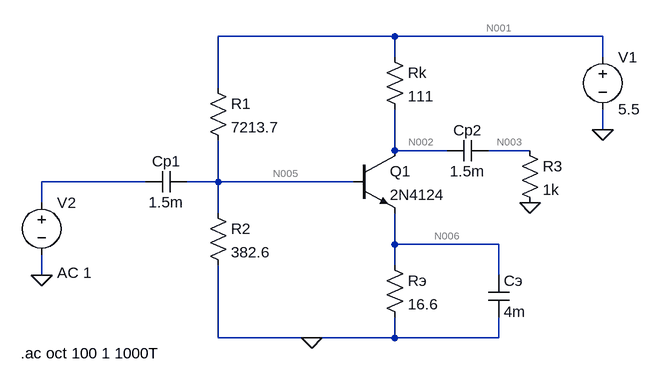
[diagram p0: schematic 2.asc]
2.asc, the LTspice schematic file:
Version 4
SHEET 1 1124 680
WIRE 560 -64 288 -64
WIRE 880 -64 560 -64
WIRE 560 -32 560 -64
WIRE 880 -32 880 -64
WIRE 288 16 288 -64
WIRE 880 80 880 48
WIRE 560 112 560 48
WIRE 640 112 560 112
WIRE 768 112 704 112
WIRE 176 160 16 160
WIRE 288 160 288 96
WIRE 288 160 240 160
WIRE 496 160 288 160
WIRE 16 192 16 160
WIRE 288 208 288 160
WIRE 560 256 560 208
WIRE 720 256 560 256
WIRE 560 288 560 256
WIRE 16 304 16 272
WIRE 720 304 720 256
WIRE 288 400 288 288
WIRE 432 400 288 400
WIRE 560 400 560 368
WIRE 560 400 432 400
WIRE 720 400 720 368
WIRE 720 400 560 400
FLAG 16 304 0
FLAG 432 400 0
FLAG 880 80 0
FLAG 768 192 0
SYMBOL voltage 16 176 R0
WINDOW 123 24 124 Left 2
WINDOW 39 0 0 Left 0
SYMATTR Value2 AC 1
SYMATTR InstName V2
SYMATTR Value ""
SYMBOL cap 240 144 R90
WINDOW 0 0 32 VBottom 2
WINDOW 3 32 32 VTop 2
SYMATTR InstName Cp1
SYMATTR Value 1.5m
SYMBOL res 272 0 R0
SYMATTR InstName R1
SYMATTR Value 7213.7
SYMBOL res 272 192 R0
SYMATTR InstName R2
SYMATTR Value 382.6
SYMBOL res 544 272 R0
SYMATTR InstName Rэ
SYMATTR Value 16.6
SYMBOL res 544 -48 R0
SYMATTR InstName Rk
SYMATTR Value 111
SYMBOL npn 496 112 R0
SYMATTR InstName Q1
SYMATTR Value 2N4124
SYMBOL cap 704 304 R0
SYMATTR InstName Cэ
SYMATTR Value 4m
SYMBOL cap 704 96 R90
WINDOW 0 0 32 VBottom 2
WINDOW 3 32 32 VTop 2
SYMATTR InstName Cp2
SYMATTR Value 1.5m
SYMBOL voltage 880 -48 R0
WINDOW 123 0 0 Left 0
WINDOW 39 0 0 Left 0
SYMATTR InstName V1
SYMATTR Value 5.5
SYMBOL res 752 96 R0
SYMATTR InstName R3
SYMATTR Value 1k
TEXT -16 424 Left 2 !.ac oct 100 1 1000T

The netlist it stands for:
* 2.asc
V2 N004 0 AC 1
Cp1 N005 N004 1.5m
R1 N001 N005 7213.7
R2 N005 0 382.6
Rэ N006 0 16.6
Rk N001 N002 111
Q1 N002 N005 N006 0 2N4124
Cэ N006 0 4m
Cp2 N003 N002 1.5m
V1 N001 0 5.5
R3 N003 0 1k
.model NPN NPN
.model PNP PNP
.lib standard.bjt
.ac oct 100 1 1000T
.backanno
.end

* Results of the author's LTspice run, read from the files saved beside the schematic
* Operating Point, zero values left out:
*   V(n005) = 277 mV
*   V(n001) = 5.5 V
*   V(n006) = 5.858 nV
*   V(n002) = 5.5 V
*   Ic(Q1) = 328.2 pA
*   Ib(Q1) = 24.63 pA
*   Ie(Q1) = -352.9 pA
*   I(Rk) = 328.3 pA
*   I(Rэ) = 352.9 pA
*   I(R2) = 724 µA
*   I(R1) = 724 µA
*   I(V1) = -724 µA
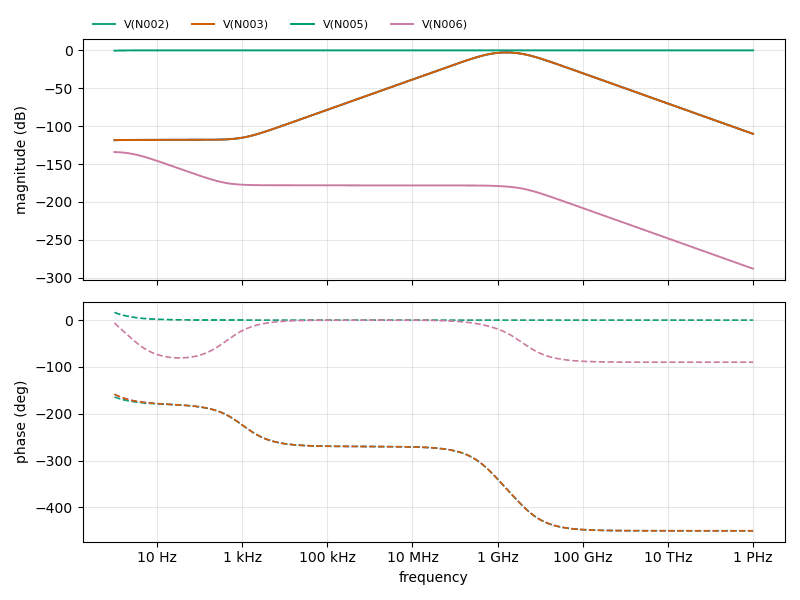
[diagram p1: AC Analysis of 2.asc, plotted from the saved traces]
* AC Analysis, 1 run:
*   V(N002): -118.43 dB at 1 Hz, -110.14 dB at 1000 THz, peak -2.76 dB at 1.605 GHz, 3 dB below the peak at 536.9 MHz and 4.814 GHz
*   V(N003): -118.48 dB at 1 Hz, -110.14 dB at 1000 THz, peak -2.76 dB at 1.605 GHz, 3 dB below the peak at 536.9 MHz and 4.814 GHz
*   V(N005): -0.36 dB at 1 Hz, 0.00 dB at 1000 THz, peak 0.00 dB at 24.54 THz
*   V(N006): -134.12 dB at 1 Hz, -288.00 dB at 1000 THz, peak -134.12 dB at 1 Hz, 3 dB below the peak at 2.959 Hz